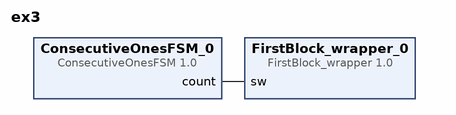
[diagram p0: block diagram of the top level]
# Vivado block design ex3, xc7a100tcsg324-3, Vivado 2016.4
create_bd_design ex3

create_bd_cell -type ip -vlnv ua.pt:user:FirstBlock_wrapper:1.0 FirstBlock_wrapper_0
create_bd_cell -type ip -vlnv xilinx.com:user:ConsecutiveOnesFSM:1.0 ConsecutiveOnesFSM_0
set_property -dict {CONFIG.times 1000} [get_bd_cells ConsecutiveOnesFSM_0]

# ---- connections ----

connect_bd_net [get_bd_pins ConsecutiveOnesFSM_0/count] [get_bd_pins FirstBlock_wrapper_0/sw]

validate_bd_design
save_bd_design
